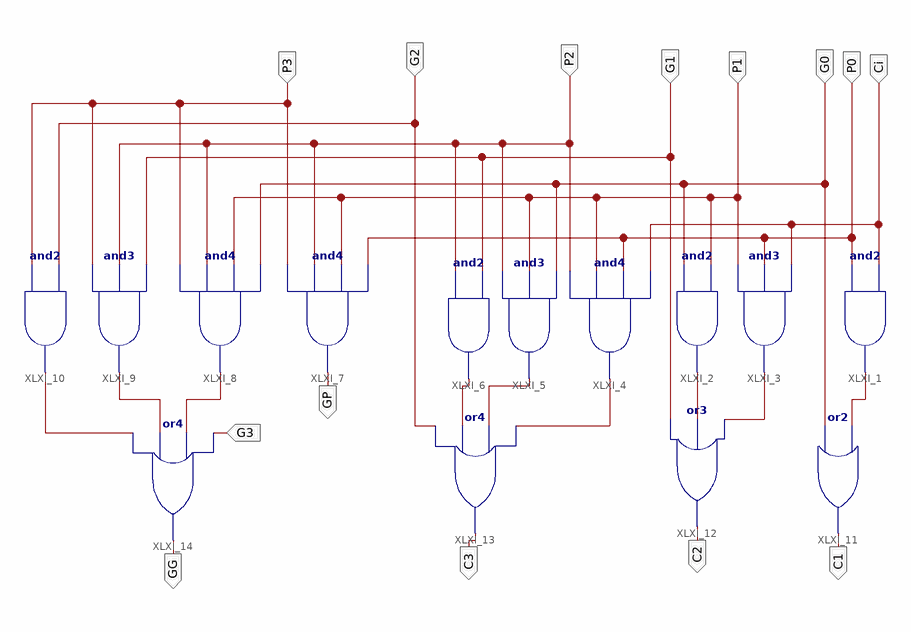
[diagram p0: schematic sheet 1]
// Xilinx ISE schematic cla.sch (kintex7) as structural Verilog: 14 symbols, 14 ports
module cla (
  input  G3,
  input  G2,
  input  Ci,
  input  P0,
  input  G0,
  input  P1,
  input  G1,
  input  P2,
  input  P3,
  output C1,
  output C2,
  output C3,
  output GG,
  output GP
);

  wire XLXN_3, XLXN_4, XLXN_5, XLXN_6, XLXN_7, XLXN_8, XLXN_10, XLXN_11, XLXN_12;

  and XLXI_1 (XLXN_3, P0, Ci);
  and XLXI_2 (XLXN_5, G0, P1);
  and XLXI_3 (XLXN_4, P1, P0, Ci);
  and XLXI_4 (XLXN_6, P2, P1, P0, Ci);
  and XLXI_5 (XLXN_7, P2, P1, G0);
  and XLXI_6 (XLXN_8, P2, G1);
  and XLXI_7 (GP, P3, P2, P1, P0);
  and XLXI_8 (XLXN_10, P3, P2, P1, G0);
  and XLXI_9 (XLXN_11, P3, P2, G1);
  and XLXI_10 (XLXN_12, P3, G2);
  or XLXI_11 (C1, G0, XLXN_3);
  or XLXI_12 (C2, G1, XLXN_5, XLXN_4);
  or XLXI_13 (C3, G2, XLXN_8, XLXN_7, XLXN_6);
  or XLXI_14 (GG, XLXN_12, XLXN_11, XLXN_10, G3);
endmodule
